# EasyEDA Pro project 电源板48-24.eprj, schematic 原理图
Board Name: 48V转换; Create Date: 2024-04-22; Page Name: 主控MCU; Project Name: 电源板48-24; Schematic Name: 原理图; Update Date: 2025-04-11; Company: 嘉立创EDA; Page Size: A3; Version: V1.0
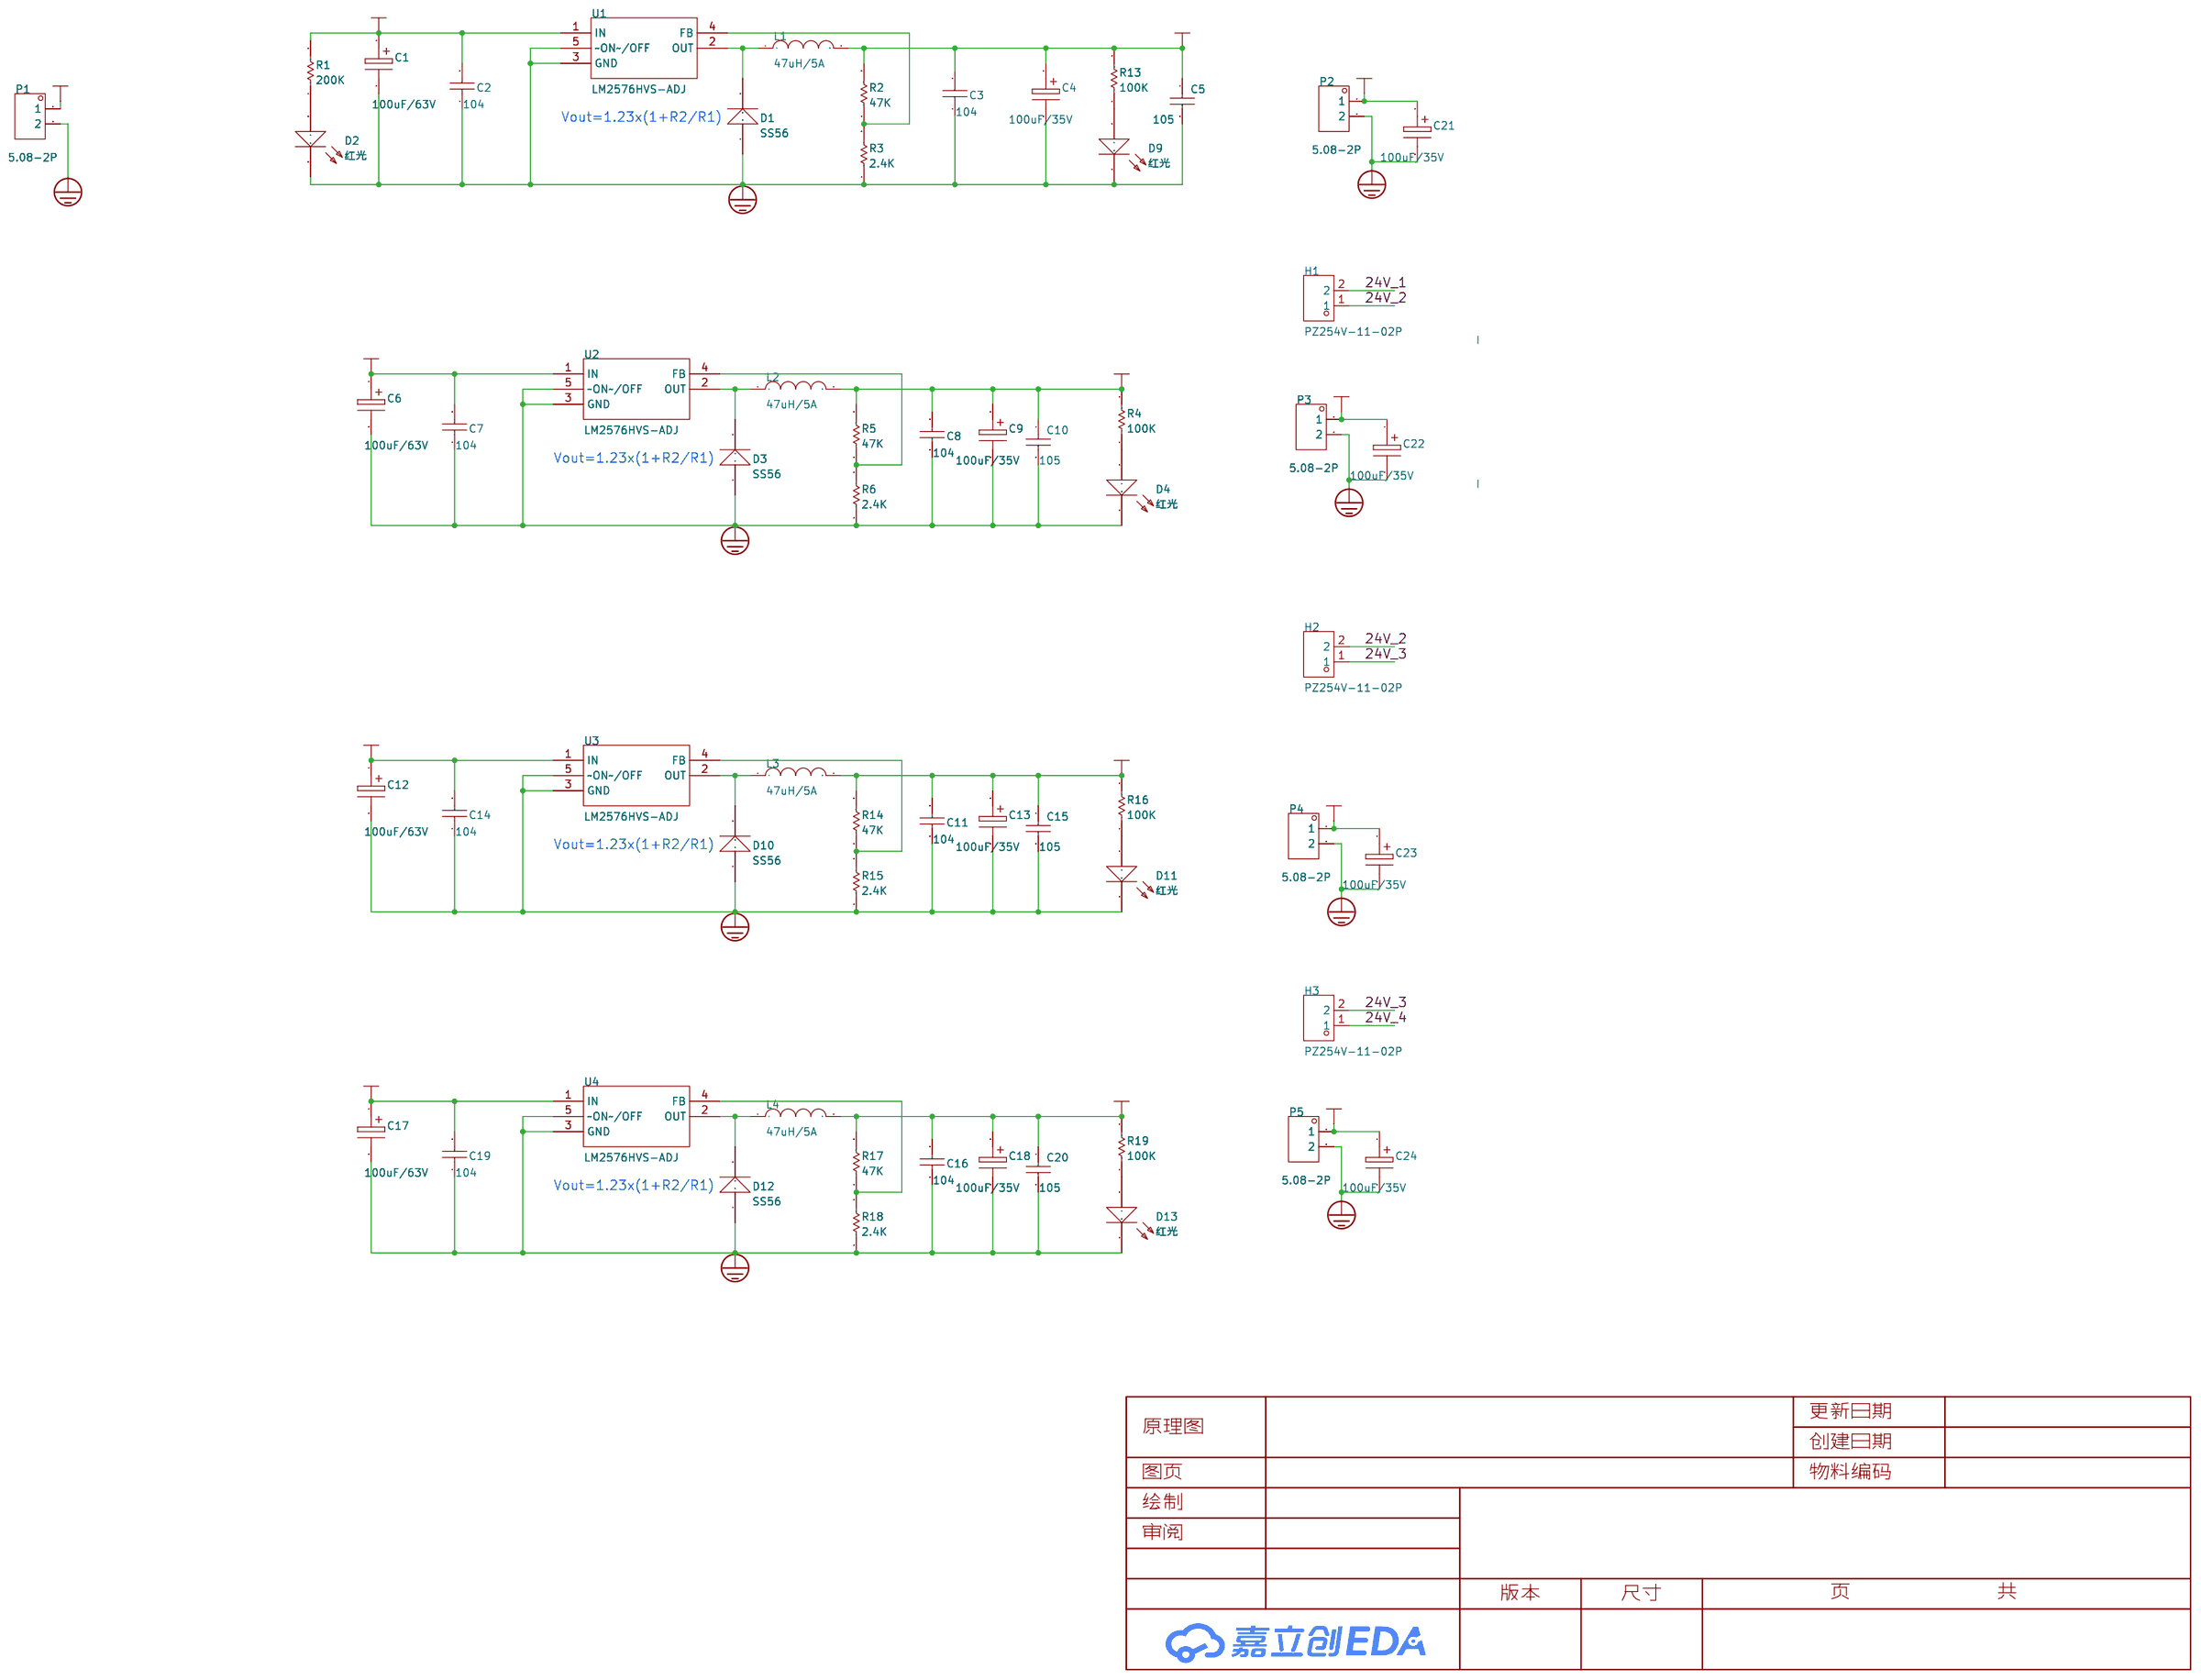
[diagram p0: schematic sheet]

## Parts
C1  100uF/63V  [电解电容贴片10x10]
C2  104  [0805C]
C3  104  [0805C]
C4  100uF/35V  [电解电容贴片6X6]
C5  105  [0805C]
C6  100uF/63V  [电解电容贴片10x10]
C7  104  [0805C]
C8  104  [0805C]
C9  100uF/35V  [电解电容贴片6X6]
C10  105  [0805C]
C11  104  [0805C]
C12  100uF/63V  [电解电容贴片10x10]
C13  100uF/35V  [电解电容贴片6X6]
C14  104  [0805C]
C15  105  [0805C]
C16  104  [0805C]
C17  100uF/63V  [电解电容贴片10x10]
C18  100uF/35V  [电解电容贴片6X6]
C19  104  [0805C]
C20  105  [0805C]
C21  100uF/35V  [电解电容贴片6X6]
C22  100uF/35V  [电解电容贴片6X6]
C23  100uF/35V  [电解电容贴片6X6]
C24  100uF/35V  [电解电容贴片6X6]
D1  SS56  [SMA]
D2  红光  [0603LED]
D3  SS56  [SMA]
D4  红光  [0603LED]
D9  红光  [0603LED]
D10  SS56  [SMA]
D11  红光  [0603LED]
D12  SS56  [SMA]
D13  红光  [0603LED]
H1  PZ254V-11-02P  [HDR-TH_2P-P2.54-V-M]
H2  PZ254V-11-02P  [HDR-TH_2P-P2.54-V-M]
H3  PZ254V-11-02P  [HDR-TH_2P-P2.54-V-M]
L1  47uH/5A  [IND-SMD_L13.45-W12.6]
L2  47uH/5A  [IND-SMD_L13.45-W12.6]
L3  47uH/5A  [IND-SMD_L13.45-W12.6]
L4  47uH/5A  [IND-SMD_L13.45-W12.6]
P1  5.08-2P  [CONN-TH_WJ2EDGVC-5.08-2P]
P2  5.08-2P  [CONN-TH_WJ2EDGVC-5.08-2P]
P3  5.08-2P  [CONN-TH_WJ2EDGVC-5.08-2P]
P4  5.08-2P  [CONN-TH_WJ2EDGVC-5.08-2P]
P5  5.08-2P  [CONN-TH_WJ2EDGVC-5.08-2P]
R1  10K  [0603R]
R2  47K  [0603R]
R3  2.4K  [0603R]
R4  10K  [0603R]
R5  47K  [0603R]
R6  2.4K  [0603R]
R13  10K  [0603R]
R14  47K  [0603R]
R15  2.4K  [0603R]
R16  10K  [0603R]
R17  47K  [0603R]
R18  2.4K  [0603R]
R19  10K  [0603R]
U1  LM2576HVS-ADJ  [TO-263]
U2  LM2576HVS-ADJ  [TO-263]
U3  LM2576HVS-ADJ  [TO-263]
U4  LM2576HVS-ADJ  [TO-263]

## Library data of the parts
C1 C6 C12 C17 = 100uF/63V: Origin Footprint 2: X47U; Design Item ID: ELECTRO1; Library Name: *
C2 C3 C7 C8 C11 C14 C16 C19 = 104: Origin Footprint 2: CAP; Design Item ID: CAP; Library Name: SCH封装库
C4 C9 C13 C18 C21-C24 = 100uF/35V: Origin Footprint 2: X47U; Origin Footprint 1: 电解电容贴片6x6; Design Item ID: ELECTRO1; Library Name: *
C5 C10 C15 C20 = 105: Design Item ID: CAP; Library Name: SCH封装库
D1 D3 D10 D12 = SS56: Design Item ID: 1N4148; Library Name: SCH封装库
D2 D4 D9 D11 D13 = 红光: Origin Footprint 2: LED(小); Design Item ID: LED; Library Name: SCH封装库
H1-H3 = PZ254V-11-02P: 插针结构:1x2P;间距:2.54mm;行距:-;圆针/方针:方针;安装类型:直插;排数:单排;总PIN位数:2P;额定电流:-;额定电压:-;配合针长度:6mm;塑高:2.5mm;端接针长度:3mm;触头材质:黄铜;触头镀层:-;工作温度范围:-40℃~+105℃;颜色:黑色;; LCSC Part Name: 间距:2.54mm 1x2P 直插 方针; Supplier Part: C492401; Manufacturer: XFCN(兴飞); Supplier Footprint: 插件,P=2.54mm; JLCPCB Part Class: 扩展库; Datasheet: https://atta.szlcsc.com/upload/public/pdf/source/20200309/C492401_A812433581A9B211A7FFA413ADDFF0E5.pdf; Supplier: LCSC; Pin Structure: 1x2P; Pitch: 2.54mm; Circluar Pins/Square Pins: 方针; Mounting Type: 直插; Number of Rows: 单排; Number of Pins: 2P; Length of Mating Pin: 6mm; Insulation Height: 2.5mm; Length of End Connection Pin: 3mm; Contact Material: 黄铜; Operating Temperature Range: -40℃~+105℃; Color: 黑色
L1-L4 = 47uH/5A: Inductor; Published: 8-Jun-2000; LatestRevisionDate: 29-May-2009; LatestRevisionNote: IPC-7351 Footprint Added.; PackageReference: 0402-A; Publisher: Altium Limited; PackageDescription: Chip Inductor; Code_JEITA: 0402; Code_IEC: 1005; Origin Footprint 2: INDC1608L; Origin Footprint 3: INDC2012L; Origin Footprint 4: INDC0603L; Origin Footprint 5: INDC3216AL; Origin Footprint 6: INDC4532L; Origin Footprint 1: 电感贴片12x12; Design Item ID: Inductor; Library Name: SCH封装库
P1-P5 = WJ2EDGVC-5.08-2P: LCSC Part Name: 1x2P 5.08mm 排数:1 每排P数:2; Supplier Part: C8445; Manufacturer: KANGNEX(康奈克斯电气); Supplier Footprint: 插件,P=5.08mm; JLCPCB Part Class: 扩展库; Datasheet: https://atta.szlcsc.com/upload/public/pdf/source/20191225/C8445_EB1D2D396D429FBA4C627FE17CC77AF0.pdf; Supplier: LCSC; Connector Type: 板端/插座-闭口; Structure: 1x2P; Pitch: 5.08mm; Color: 绿色; Mounting Style: 直针; Number of Pins: 2P; Number of Rows: 1; Number of PINs Per Row: 2; Current Rating (Max): 20A; Voltage Rating (Max): 450V; Contact Material: 黄铜; Contact Plating: 锡; Operating Temperature Range: -40℃~+105℃
R1 R4 R13 R16 R19 = 10K: Resistor; Published: 8-Jun-2000; LatestRevisionDate: 17-Jul-2002; LatestRevisionNote: Re-released for DXP Platform.; PackageReference: AXIAL-0.3; Publisher: Altium Limited; Origin Footprint 2: AXIAL-0.3; Origin Footprint 3: R0805; Origin Footprint 4: 0805R; Design Item ID: RES; Library Name: SCH封装库
R2 R5 R14 R17 = 44.2K: Resistor; Published: 8-Jun-2000; LatestRevisionDate: 17-Jul-2002; LatestRevisionNote: Re-released for DXP Platform.; PackageReference: AXIAL-0.3; Publisher: Altium Limited; Origin Footprint 2: AXIAL-0.3; Origin Footprint 3: R0805; Design Item ID: RES; Library Name: SCH封装库
R3 R6 R15 R18 = 2.37K: Resistor; Published: 8-Jun-2000; LatestRevisionDate: 17-Jul-2002; LatestRevisionNote: Re-released for DXP Platform.; PackageReference: AXIAL-0.3; Publisher: Altium Limited; Origin Footprint 2: AXIAL-0.3; Origin Footprint 3: R0805; Design Item ID: RES; Library Name: SCH封装库
U1-U4 = LM2576HVS-ADJ: Simple Switcher 3A Step Down Voltage Regulator; Published: 15-Apr-2002; DatasheetVersion: Jun-1999; PackageReference: TS5B; Publisher: Altium Limited; PackageDescription: D2-PAK; 5 Leads; Body 14.4 (inc. leads) x 10.4 mm (LxW max); Note: Tab is connected to GND; ComponentLink1Description: Manufacturer Link; ComponentLink1URL: http://www.national.com/; ComponentLink2Description: Datasheet; ComponentLink2URL: http://www.national.com/ds.cgi/LM/LM2576.pdf; ComponentLink3Description: URL Link1; ComponentLink3URL: http://www.national.com/pf/LM/LM2576.html; Design Item ID: LM2576S-5.0; Library Name: NSC Power Mgt Switching Regulator; Datasheet: http://www.national.com/ds.cgi/LM/LM2576.pdf

## Nets
24V_1: C3.2 C4.1 C5.1 C21.1 H1.2 L1.2 P2.1 R2.2 R13.2
24V_2: C8.2 C9.1 C10.1 C22.1 H1.1 H2.2 L2.2 P3.1 R4.2 R5.2
24V_3: C11.2 C13.1 C15.1 C23.1 H2.1 H3.2 L3.2 P4.1 R14.2 R16.2
24V_4: C16.2 C18.1 C20.1 C24.1 H3.1 L4.2 P5.1 R17.2 R19.2
48V_IN: C1.1 C2.2 C6.1 C7.2 C12.1 C14.2 C17.1 C19.2 P1.1 R1.2 U1.1(IN) U2.1(IN) U3.1(IN) U4.1(IN)
GND: C1.2 C2.1 C3.1 C4.2 C5.2 C6.2 C7.1 C8.1 C9.2 C10.2 C11.1 C12.2 C13.2 C14.1 C15.2 C16.1 C17.2 C18.2 C19.1 C20.2 C21.2 C22.2 C23.2 C24.2 D1.1 D2.2 D3.1 D4.2 D9.2 D10.1 D11.2 D12.1 D13.2 P1.2 P2.2 P3.2 P4.2 P5.2 R3.1 R6.1 R15.1 R18.1 U1.3(GND) U1.5(~ON~/OFF) U2.3(GND) U2.5(~ON~/OFF) U3.3(GND) U3.5(~ON~/OFF) U4.3(GND) U4.5(~ON~/OFF)
$1N74180: D1.2 L1.1 U1.2(OUT)
$1N74181: R2.1 R3.2 U1.4(FB)
$1N74206: D2.1 R1.1
$1N76111: D9.1 R13.1
Net-(D3-2): D3.2 L2.1 U2.2(OUT)
Net-(D4-1): D4.1 R4.1
Net-(D10-2): D10.2 L3.1 U3.2(OUT)
Net-(D11-1): D11.1 R16.1
Net-(D12-2): D12.2 L4.1 U4.2(OUT)
Net-(D13-1): D13.1 R19.1
Net-(R5-1): R5.1 R6.2 U2.4(FB)
Net-(R14-1): R14.1 R15.2 U3.4(FB)
Net-(R17-1): R17.1 R18.2 U4.4(FB)

## Notes on the sheet
- Vout=1.23x(1+R2/R1)
- Vout=1.23x(1+R2/R1)
- Vout=1.23x(1+R2/R1)
- Vout=1.23x(1+R2/R1)
